# EAGLE design eagle_designV3 (EAGLE 9.2.1)
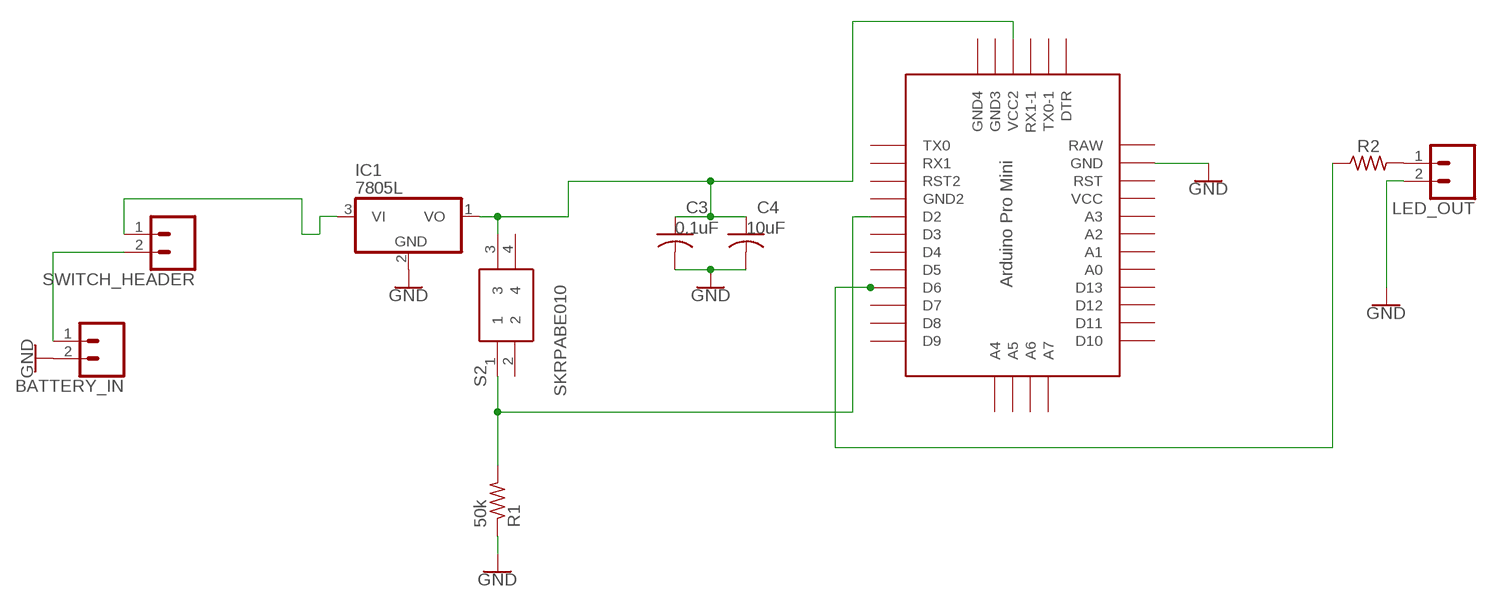
[diagram p0: schematic, sheet 1]

## Parts
BATTERY_IN  CONN_02  [1X02]
C3  0.1uF  C-USC0805  [C0805]
C4  10uF  C-USC0805  [C0805]
IC1  7805L  [TO92]
LED_OUT  CONN_02  [1X02]
R1  50k  R-US_R0805  [R0805]
R2  330  R-US_R0805  [R0805]
S2  SKRPABE010  [SMT(4.2X3.2)]
SWITCH_HEADER  CONN_02  [1X02]
U$1  PRO-MINI  [PRO-MINI]

## Nets
GND: BATTERY_IN.2 C3.2 C4.2 IC1.2(GND) LED_OUT.2 R1.1 U$1.GND
N$1: BATTERY_IN.1 SWITCH_HEADER.2
N$2: IC1.3(VI) SWITCH_HEADER.1
N$4: C3.1 C4.1 IC1.1(VO) S2.3 U$1.VCC1(VCC2)
N$5: R1.2 S2.1 U$1.D2
N$6: R2.1 U$1.D6
N$7: LED_OUT.1 R2.2
Unconnected: S2.2 S2.4 U$1.A0 U$1.A1 U$1.A2 U$1.A3 U$1.A4 U$1.A5 U$1.A6 U$1.A7 U$1.D3 U$1.D4 U$1.D5 U$1.D7 U$1.D8 U$1.D9 U$1.D10 U$1.D11 U$1.D12 U$1.D13 U$1.DTR U$1.GND1(GND2) U$1.GND2(GND4) U$1.GND3 U$1.RST U$1.RST1(RST2) U$1.RX1 U$1.RX1-1 U$1.TX0 U$1.TX0-1 U$1.VCC

## Power pins joined to a net without a drawn wire
RAW: U$1.RAW

## Library data of the parts
BATTERY_IN LED_OUT SWITCH_HEADER = SparkFun-Connectors:CONN_02: Multi connection point. Often used as Generic Header-pin footprint for 0.1 inch spaced/style header connections On any of the 0.1 inch spaced packages, you can populate with these: Break Away Headers - Straight <https://www.sparkfun.com/products/116> (PRT-00116) Break Away Male Headers - Right Angle <https://www.sparkfun.com/products/553> (PRT-00553) Female Headers <https://www.sparkfun.com/products/115> (PRT-00115) Break Away Headers - Machine Pin <https://www.sparkfun.com/products/117> (PRT-00117) Break Away Female Headers - Swiss Machine Pin <https://www.sparkfun.com/products/743> (PRT-00743) For SCREWTERMINALS and SPRING TERMINALS visit here: Screw Terimnals on SparkFun.com <https://www.sparkfun.com/search/results?term=Screw+Terminals> (5mm/3.5mm/2.54mm spacing) This device is also useful as a general connection point to wire up your design to another part of your project. Our various solder wires solder well into these plated through hole pads. Hook-Up Wire - Assortment (Stranded, 22 AWG) <https://www.sparkfun.com/products/11375> (PRT-11375) Hook-Up Wire - Assortment (Solid Core, 22 AWG) <https://www.sparkfun.com/products/11367> (PRT-11367) View the entire wire category on our website here <https://www.sparkfun.com/categories/141> Special notes: Molex polarized connector foot print use with: PRT-08233 with associated crimp pins and housings. 2.54_SCREWTERM for use with PRT-10571. 3.5mm Screw Terminal footprints for PRT-08084 5mm Screw Terminal footprints for use with PRT-08432
C3 = adafruit:C-US: CAPACITOR, American symbol; CAP: 0.1uF
C4 = adafruit:C-US: CAPACITOR, American symbol; CAP: 10uF
IC1 = adafruit:78*: Positive VOLTAGE REGULATOR Added bigger pads to the TO-92 package
R1 R2 = adafruit:R-US_: RESISTOR, American symbol
S2 = SKRPABE010:SKRPABE010: Switch Tactile 4.2 x 3.2mm SMT 1.57N Black Button Tactile Switch, SPST-NO 0.05 A 0.7mm Source: Datasheet <https://componentsearchengine.com/Datasheets/1/SKRPABE010.pdf>; DESCRIPTION: Switch Tactile 4.2 x 3.2mm SMT 1.57N Black Button Tactile Switch, SPST-NO 0.05 A 0.7mm; HEIGHT: mm; MANUFACTURER_NAME: ALPS; MANUFACTURER_PART_NUMBER: SKRPABE010; MOUSER_PART_NUMBER: 688-SKRPAB
U$1 = Arduino-clone:PRO-MINI: Arduion Pro Mini Clone V1.0 www.betemcu.cu

## Net classes
0 default: width 0.203 mm
1 vcc: width 0.254 mm

## Board
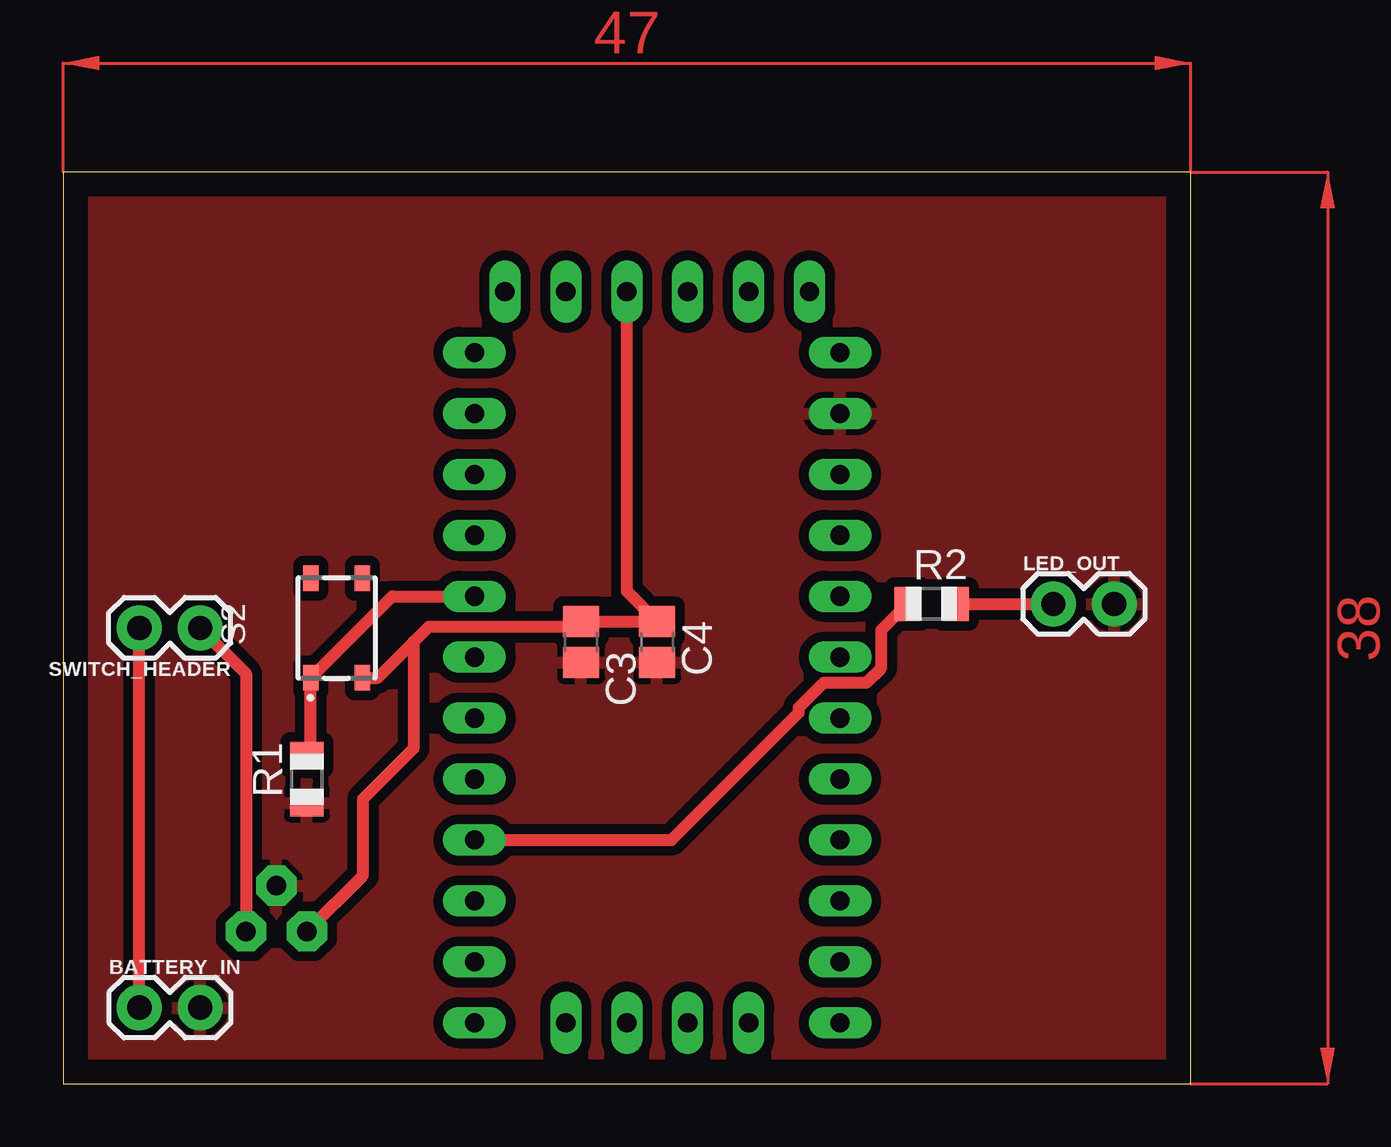
[diagram p1: board, top side]
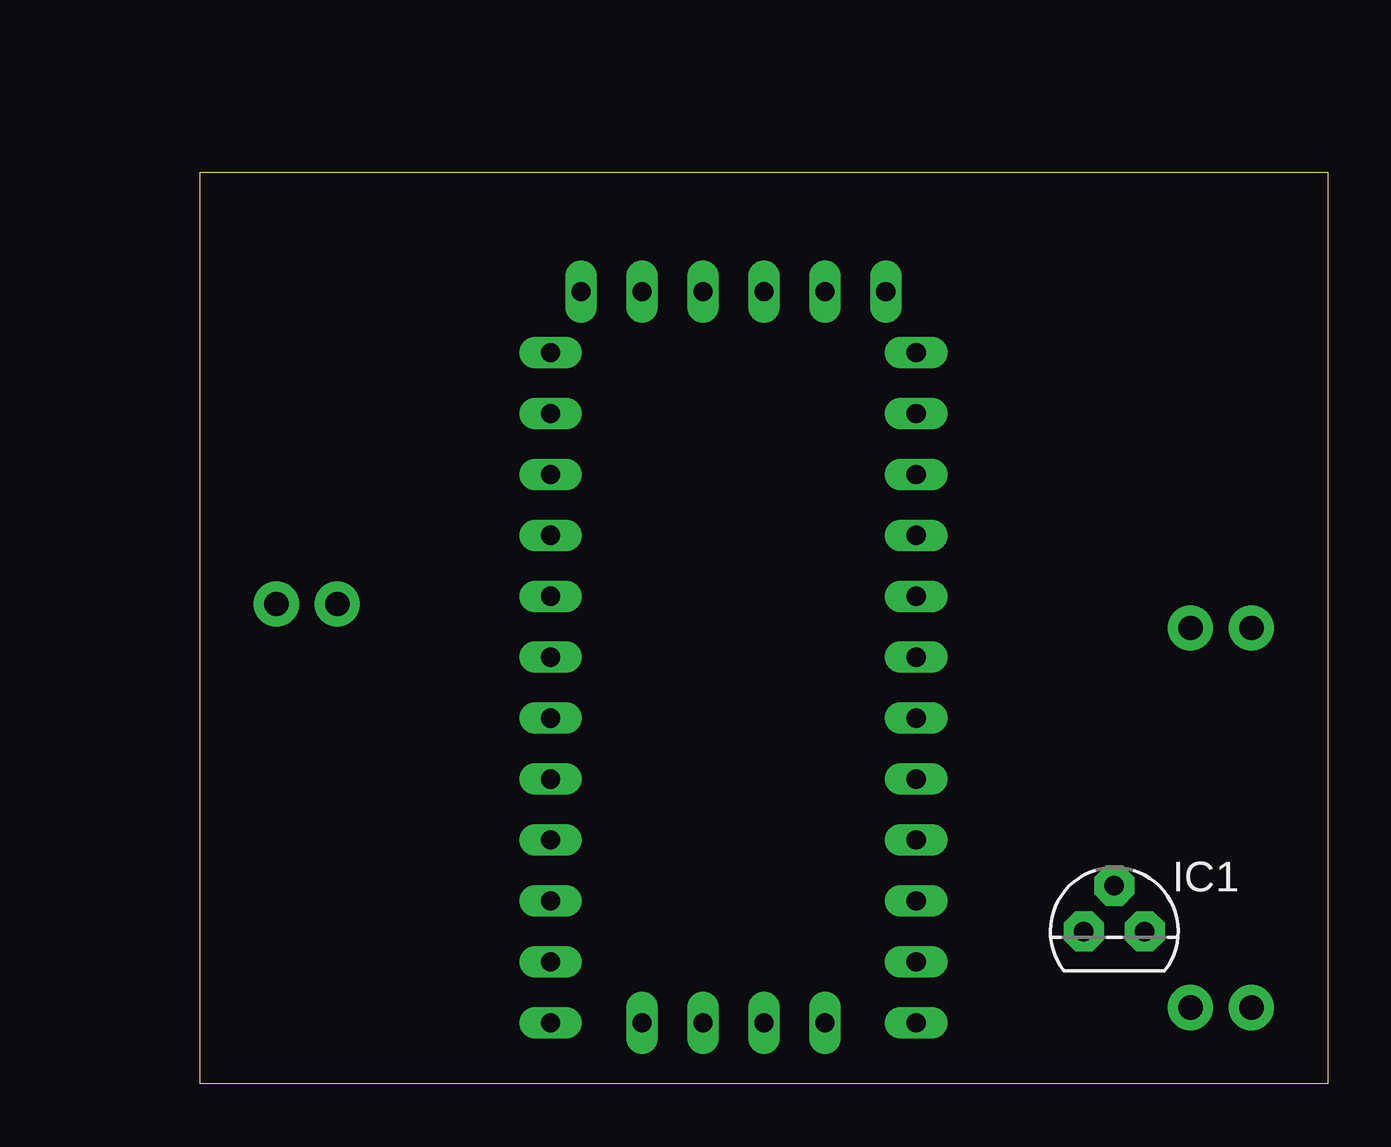
[diagram p2: board, bottom side, seen from below]

Size 47 x 38 mm. Coordinates in mm from the lower left corner, seen from the top.
Outline: 0,0 47,0 47,38 0,38 0,0
Copper layers (1*16): Top 0.035mm / dielectric 1.5mm / Bottom 0.035mm
Design rules "default": minimum track width 6mil, minimum drill 0.35mm, track to track 6mil, track to pad 6mil, pad to pad 6mil, via to via 6mil, smd to smd 6mil, copper to edge 40mil, drill to drill 6mil, minimum pad ring 10mil, minimum via ring 8mil, stop-mask expansion 4mil, vias tented up to drill 0mil, thermal gap 10mil

### Footprints (pad centres in the part's own frame; a part is rotated, then mirrored left to right if it is on the bottom)
1X02 = drill 1.016 pad 1.88: 1 0,0; 2 2.54,0
C0805 = smd 1.3 x 1.5: 1 -0.85,0; 2 0.85,0
TO92 = drill 0.813 pad 1.676 octagon: 1 -1.27,0; 2 0,1.905; 3 1.27,0
R0805 = smd 1.1 x 1.4: 1 -1,0; 2 1,0
SMT(4.2X3.2) = smd 1.05 x 0.65: 1 -2.075,1.075; 2 2.075,1.075; 3 -2.075,-1.075; 4 2.075,-1.075
PRO-MINI = drill 0.8 long: A0 8.89,8.89; A1 8.89,11.43; A2 8.89,13.97; A3 8.89,16.51; A4 -2.54,-1.27; A5 0,-1.27; A6 2.54,-1.27; A7 5.08,-1.27; D2 -6.35,16.51; D3 -6.35,13.97; D4 -6.35,11.43; D5 -6.35,8.89; D6 -6.35,6.35; D7 -6.35,3.81; D8 -6.35,1.27; D9 -6.35,-1.27; D10 8.89,-1.27; D11 8.89,1.27; D12 8.89,3.81; D13 8.89,6.35; DTR 7.62,29.21; GND 8.89,24.13; GND1 -6.35,19.05; GND2 -5.08,29.21; GND3 -2.54,29.21; RAW 8.89,26.67; RST 8.89,21.59; RST1 -6.35,21.59; RX1 -6.35,24.13; RX1-1 2.54,29.21; TX0 -6.35,26.67; TX0-1 5.08,29.21; VCC 8.89,19.05; VCC1 0,29.21

### Placement (x,y rotation side)
BATTERY_IN  3.17,3.17 0 top
C3  21.59,18.41 270 top
C4  24.77,18.41 270 top
IC1  8.89,6.35 0 bottom
LED_OUT  41.27,20 0 top
R1  10.16,12.7 90 top
R2  36.2,20 0 top
S2  11.4,19 90 top
SWITCH_HEADER  5.71,19 180 top
U$1  23.5,3.81 0 top

### Tracks (layer width: path | path; a pad name or v marks a point on that pad's centre or on a via)
GND
  pour Top (isolate 0.406): 0,0 0,38.1 46.99,38.1 46.99,0
N$1
  Top 0.508: BATTERY_IN.1 SWITCH_HEADER.2
N$2
  Top 0.508: SWITCH_HEADER.1 7.62,17.09 IC1.3
N$4
  Top 0.203: 12.51,16.7 S2.3
  Top 0.508: IC1.1 12.51,8.7 12.51,11.87 14.61,13.97 14.61,18.41 | 14.61,18.41 15.24,19.05 21.38,19.05 C3.1 C4.1 23.5,20.54 U$1.VCC1 | S2.3 13.12,16.93 14.61,18.41
N$5
  Top 0.508: R1.2 10.32,13.87 S2.1 13.72,20.32 U$1.D2
N$6
  Top 0.508: U$1.D6 25.36,10.16 30.67,15.48 30.67,15.68 31.71,16.72 33.48,16.72 34.1,17.34 34.1,18.9 R2.1
N$7
  Top 0.508: R2.2 LED_OUT.1
(copper drawn outside any net)
  shapes: Top area x2